# Altium project miniBackplane_SFP.PrjPCB
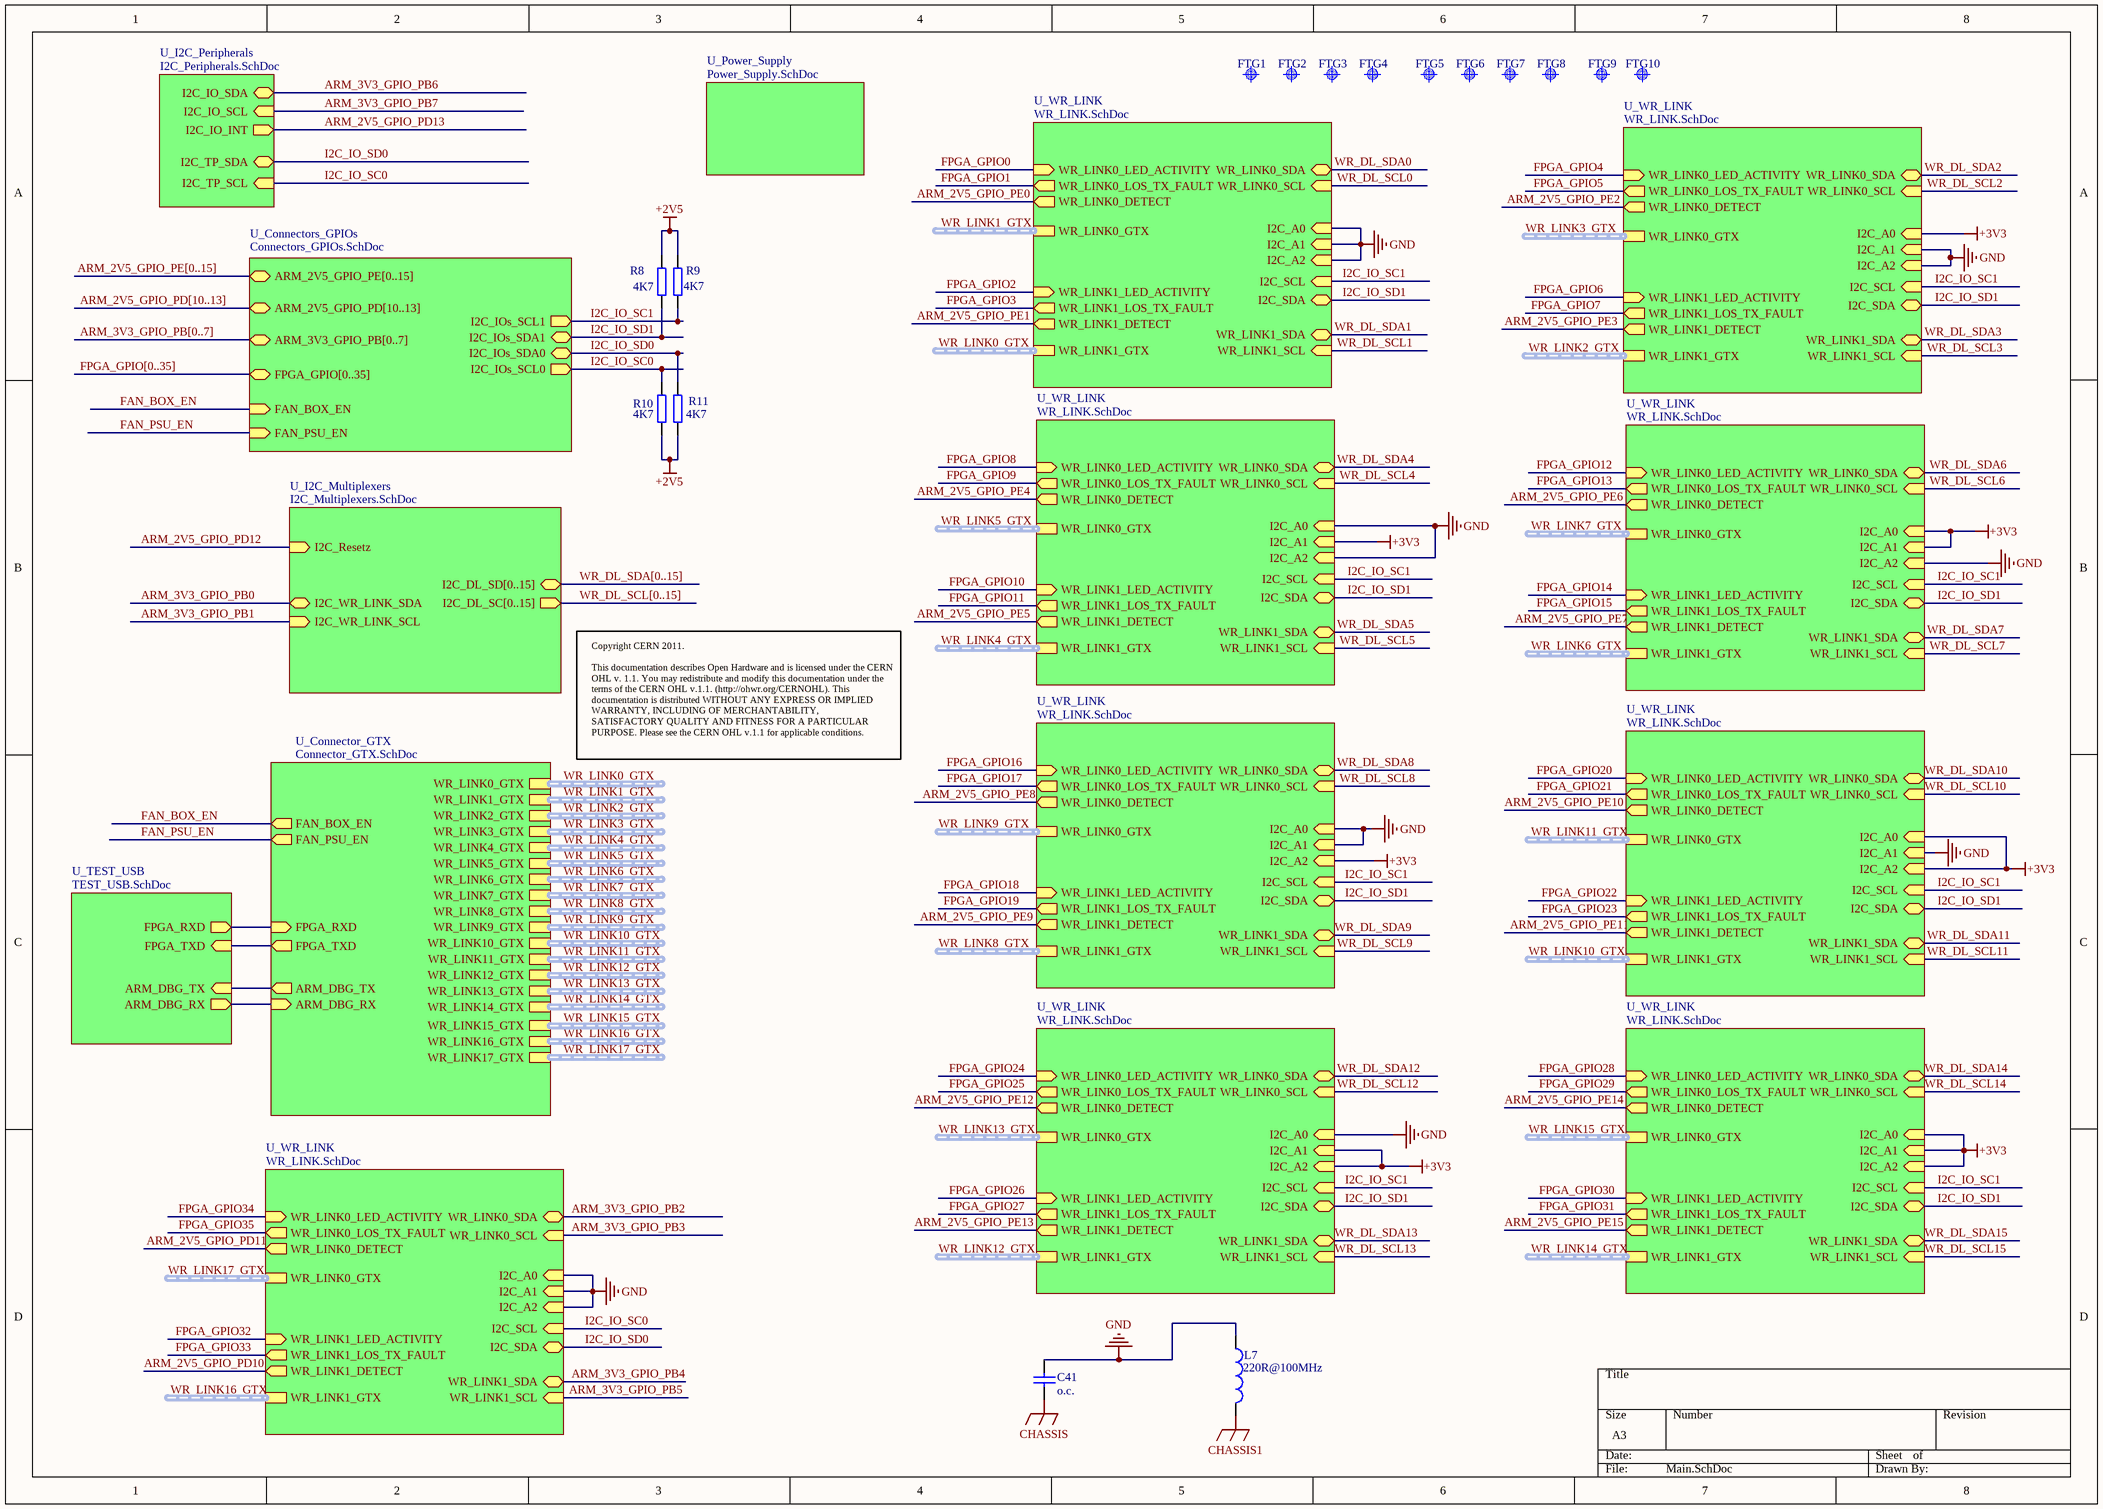
[diagram p0: Main.SchDoc]
3 sheets, 66 parts. Net scope: hierarchical (ports join the sheet entries above them; power ports are global).
Board file: miniBackplane.PcbDoc
Sheets:
  Main.SchDoc
    U_TEST_USB = TEST_USB.SchDoc
    U_Connectors_GPIOs = Connectors_GPIOs.SchDoc

## Sheet Main.SchDoc
size A3

### Parts
C41  o.c.  [CC1608-0603]
FTG1  Use only in PCB  [FIDUCIAL_TOP_S100-200]  (value not drawn)
FTG2  Use only in PCB  [FIDUCIAL_TOP_S100-200]  (value not drawn)
FTG3  Use only in PCB  [FIDUCIAL_TOP_S100-200]  (value not drawn)
FTG4  Use only in PCB  [FIDUCIAL_TOP_S100-200]  (value not drawn)
FTG5  Use only in PCB  [FIDUCIAL_TOP_S100-200]  (value not drawn)
FTG6  Use only in PCB  [FIDUCIAL_TOP_S100-200]  (value not drawn)
FTG7  Use only in PCB  [FIDUCIAL_TOP_S100-200]  (value not drawn)
FTG8  Use only in PCB  [FIDUCIAL_TOP_S100-200]  (value not drawn)
FTG9  Use only in PCB  [FIDUCIAL_TOP_S100-200]  (value not drawn)
FTG10  Use only in PCB  [FIDUCIAL_TOP_S100-200]  (value not drawn)
L7  Impedance: 220R@100MHz  [0603]  (hidden comment: 220R@100MHz Ferrite Bead)
R8  4K7  [0603]
R9  4K7  [0603]
R10  4K7  [0603]
R11  4K7  [0603]

### Sub-sheets
U_Connector_GTX = Connector_GTX.SchDoc (file not in this document): WR_LINK0_GTX (harness WR_LINK_GTX), WR_LINK1_GTX (harness WR_LINK_GTX), WR_LINK2_GTX (harness WR_LINK_GTX), WR_LINK3_GTX (harness WR_LINK_GTX), WR_LINK4_GTX (harness WR_LINK_GTX), WR_LINK5_GTX (harness WR_LINK_GTX), WR_LINK6_GTX (harness WR_LINK_GTX), WR_LINK7_GTX (harness WR_LINK_GTX), WR_LINK8_GTX (harness WR_LINK_GTX), WR_LINK9_GTX (harness WR_LINK_GTX), WR_LINK10_GTX (harness WR_LINK_GTX), WR_LINK11_GTX (harness WR_LINK_GTX), WR_LINK17_GTX (harness WR_LINK_GTX), WR_LINK16_GTX (harness WR_LINK_GTX), WR_LINK15_GTX (harness WR_LINK_GTX), WR_LINK14_GTX (harness WR_LINK_GTX), WR_LINK13_GTX (harness WR_LINK_GTX), WR_LINK12_GTX (harness WR_LINK_GTX), FPGA_RXD (in), FPGA_TXD (out), ARM_DBG_TX (out), ARM_DBG_RX (in), FAN_BOX_EN (out), FAN_PSU_EN (out)
U_Connectors_GPIOs = Connectors_GPIOs.SchDoc: ARM_2V5_GPIO_PE[0..15] (bidir), FPGA_GPIO[0..35] (bidir), I2C_IOs_SCL1 (out), I2C_IOs_SDA1 (bidir), I2C_IOs_SCL0 (out), I2C_IOs_SDA0 (bidir), ARM_2V5_GPIO_PD[10..13] (bidir), ARM_3V3_GPIO_PB[0..7] (bidir), FAN_BOX_EN (in), FAN_PSU_EN (in)
U_I2C_Multiplexers = I2C_Multiplexers.SchDoc (file not in this document): I2C_DL_SD[0..15] (bidir), I2C_DL_SC[0..15] (out), I2C_Resetz (in), I2C_WR_LINK_SDA (bidir), I2C_WR_LINK_SCL (in)
U_I2C_Peripherals = I2C_Peripherals.SchDoc (file not in this document): I2C_IO_SDA (bidir), I2C_IO_SCL (in), I2C_IO_INT (out), I2C_TP_SDA (bidir), I2C_TP_SCL (in)
U_Power_Supply = Power_Supply.SchDoc (file not in this document): no entries
U_TEST_USB = TEST_USB.SchDoc: FPGA_RXD (out), FPGA_TXD (in), ARM_DBG_TX (in), ARM_DBG_RX (out)
U_WR_LINK = WR_LINK.SchDoc (file not in this document): WR_LINK0_GTX (harness WR_LINK_GTX), I2C_A0 (in), I2C_A1 (in), I2C_A2 (in), I2C_SDA (bidir), I2C_SCL (in), WR_LINK0_SDA (bidir), WR_LINK0_SCL (in), WR_LINK0_DETECT (out), WR_LINK0_LOS_TX_FAULT (out), WR_LINK0_LED_ACTIVITY (in), WR_LINK1_LED_ACTIVITY (in), WR_LINK1_GTX (harness WR_LINK_GTX), WR_LINK1_SDA (bidir), WR_LINK1_SCL (in), WR_LINK1_DETECT (out), WR_LINK1_LOS_TX_FAULT (out)
U_WR_LINK = WR_LINK.SchDoc (file not in this document): WR_LINK0_GTX (harness WR_LINK_GTX), I2C_A0 (in), I2C_A1 (in), I2C_A2 (in), I2C_SDA (bidir), I2C_SCL (in), WR_LINK0_SDA (bidir), WR_LINK0_SCL (in), WR_LINK0_DETECT (out), WR_LINK0_LOS_TX_FAULT (out), WR_LINK0_LED_ACTIVITY (in), WR_LINK1_LED_ACTIVITY (in), WR_LINK1_GTX (harness WR_LINK_GTX), WR_LINK1_SDA (bidir), WR_LINK1_SCL (in), WR_LINK1_DETECT (out), WR_LINK1_LOS_TX_FAULT (out)
U_WR_LINK = WR_LINK.SchDoc (file not in this document): WR_LINK0_GTX (harness WR_LINK_GTX), I2C_A0 (in), I2C_A1 (in), I2C_A2 (in), I2C_SDA (bidir), I2C_SCL (in), WR_LINK0_SDA (bidir), WR_LINK0_SCL (in), WR_LINK0_DETECT (out), WR_LINK0_LOS_TX_FAULT (out), WR_LINK0_LED_ACTIVITY (in), WR_LINK1_LED_ACTIVITY (in), WR_LINK1_GTX (harness WR_LINK_GTX), WR_LINK1_SDA (bidir), WR_LINK1_SCL (in), WR_LINK1_DETECT (out), WR_LINK1_LOS_TX_FAULT (out)
U_WR_LINK = WR_LINK.SchDoc (file not in this document): WR_LINK0_GTX (harness WR_LINK_GTX), I2C_A0 (in), I2C_A1 (in), I2C_A2 (in), I2C_SDA (bidir), I2C_SCL (in), WR_LINK0_SDA (bidir), WR_LINK0_SCL (in), WR_LINK0_DETECT (out), WR_LINK0_LOS_TX_FAULT (out), WR_LINK0_LED_ACTIVITY (in), WR_LINK1_LED_ACTIVITY (in), WR_LINK1_GTX (harness WR_LINK_GTX), WR_LINK1_SDA (bidir), WR_LINK1_SCL (in), WR_LINK1_DETECT (out), WR_LINK1_LOS_TX_FAULT (out)
U_WR_LINK = WR_LINK.SchDoc (file not in this document): WR_LINK0_GTX (harness WR_LINK_GTX), I2C_A0 (in), I2C_A1 (in), I2C_A2 (in), I2C_SDA (bidir), I2C_SCL (in), WR_LINK0_SDA (bidir), WR_LINK0_SCL (in), WR_LINK0_DETECT (out), WR_LINK0_LOS_TX_FAULT (out), WR_LINK0_LED_ACTIVITY (in), WR_LINK1_LED_ACTIVITY (in), WR_LINK1_GTX (harness WR_LINK_GTX), WR_LINK1_SDA (bidir), WR_LINK1_SCL (in), WR_LINK1_DETECT (out), WR_LINK1_LOS_TX_FAULT (out)
U_WR_LINK = WR_LINK.SchDoc (file not in this document): WR_LINK0_GTX (harness WR_LINK_GTX), I2C_A0 (in), I2C_A1 (in), I2C_A2 (in), I2C_SDA (bidir), I2C_SCL (in), WR_LINK0_SDA (bidir), WR_LINK0_SCL (in), WR_LINK0_DETECT (out), WR_LINK0_LOS_TX_FAULT (out), WR_LINK0_LED_ACTIVITY (in), WR_LINK1_LED_ACTIVITY (in), WR_LINK1_GTX (harness WR_LINK_GTX), WR_LINK1_SDA (bidir), WR_LINK1_SCL (in), WR_LINK1_DETECT (out), WR_LINK1_LOS_TX_FAULT (out)
U_WR_LINK = WR_LINK.SchDoc (file not in this document): WR_LINK0_GTX (harness WR_LINK_GTX), I2C_A0 (in), I2C_A1 (in), I2C_A2 (in), I2C_SDA (bidir), I2C_SCL (in), WR_LINK0_SDA (bidir), WR_LINK0_SCL (in), WR_LINK0_DETECT (out), WR_LINK0_LOS_TX_FAULT (out), WR_LINK0_LED_ACTIVITY (in), WR_LINK1_LED_ACTIVITY (in), WR_LINK1_GTX (harness WR_LINK_GTX), WR_LINK1_SDA (bidir), WR_LINK1_SCL (in), WR_LINK1_DETECT (out), WR_LINK1_LOS_TX_FAULT (out)
U_WR_LINK = WR_LINK.SchDoc (file not in this document): WR_LINK0_GTX (harness WR_LINK_GTX), I2C_A0 (in), I2C_A1 (in), I2C_A2 (in), I2C_SDA (bidir), I2C_SCL (in), WR_LINK0_SDA (bidir), WR_LINK0_SCL (in), WR_LINK0_DETECT (out), WR_LINK0_LOS_TX_FAULT (out), WR_LINK0_LED_ACTIVITY (in), WR_LINK1_LED_ACTIVITY (in), WR_LINK1_GTX (harness WR_LINK_GTX), WR_LINK1_SDA (bidir), WR_LINK1_SCL (in), WR_LINK1_DETECT (out), WR_LINK1_LOS_TX_FAULT (out)
U_WR_LINK = WR_LINK.SchDoc (file not in this document): WR_LINK0_GTX (harness WR_LINK_GTX), I2C_A0 (in), I2C_A1 (in), I2C_A2 (in), I2C_SDA (bidir), I2C_SCL (in), WR_LINK0_SDA (bidir), WR_LINK0_SCL (in), WR_LINK0_DETECT (out), WR_LINK0_LOS_TX_FAULT (out), WR_LINK0_LED_ACTIVITY (in), WR_LINK1_LED_ACTIVITY (in), WR_LINK1_GTX (harness WR_LINK_GTX), WR_LINK1_SDA (bidir), WR_LINK1_SCL (in), WR_LINK1_DETECT (out), WR_LINK1_LOS_TX_FAULT (out)

### Nets
+2V5: R8.2 R9.1 R10.2 R11.1
+3V3: sheet U_WR_LINK/I2C_A0, sheet U_WR_LINK/I2C_A1, sheet U_WR_LINK/I2C_A0, sheet U_WR_LINK/I2C_A1, sheet U_WR_LINK/I2C_A2, sheet U_WR_LINK/I2C_A0, sheet U_WR_LINK/I2C_A2, sheet U_WR_LINK/I2C_A1, sheet U_WR_LINK/I2C_A2, sheet U_WR_LINK/I2C_A0, sheet U_WR_LINK/I2C_A1, sheet U_WR_LINK/I2C_A2
CHASSIS: C41.1
CHASSIS1: L7.2
GND: C41.2 L7.1 ; sheet U_WR_LINK/I2C_A0, sheet U_WR_LINK/I2C_A1, sheet U_WR_LINK/I2C_A2, sheet U_WR_LINK/I2C_A1, sheet U_WR_LINK/I2C_A2, sheet U_WR_LINK/I2C_A0, sheet U_WR_LINK/I2C_A2, sheet U_WR_LINK/I2C_A2, sheet U_WR_LINK/I2C_A0, sheet U_WR_LINK/I2C_A1, sheet U_WR_LINK/I2C_A1, sheet U_WR_LINK/I2C_A0, sheet U_WR_LINK/I2C_A0, sheet U_WR_LINK/I2C_A1, sheet U_WR_LINK/I2C_A2
FAN_BOX_EN: sheet U_Connector_GTX/FAN_BOX_EN, sheet U_Connectors_GPIOs/FAN_BOX_EN
FAN_PSU_EN: sheet U_Connector_GTX/FAN_PSU_EN, sheet U_Connectors_GPIOs/FAN_PSU_EN
I2C_IO_SC0: R10.1 ; sheet U_Connectors_GPIOs/I2C_IOs_SCL0, sheet U_WR_LINK/I2C_SCL, sheet U_I2C_Peripherals/I2C_TP_SCL  [project net FPGA-GPIO37]
I2C_IO_SC1: R9.2 ; sheet U_Connectors_GPIOs/I2C_IOs_SCL1, sheet U_WR_LINK/I2C_SCL, sheet U_WR_LINK/I2C_SCL, sheet U_WR_LINK/I2C_SCL, sheet U_WR_LINK/I2C_SCL, sheet U_WR_LINK/I2C_SCL, sheet U_WR_LINK/I2C_SCL, sheet U_WR_LINK/I2C_SCL, sheet U_WR_LINK/I2C_SCL  [project net FPGA-GPIO39]
I2C_IO_SD0: R11.2 ; sheet U_Connectors_GPIOs/I2C_IOs_SDA0, sheet U_WR_LINK/I2C_SDA, sheet U_I2C_Peripherals/I2C_TP_SDA  [project net FPGA-GPIO36]
I2C_IO_SD1: R8.1 ; sheet U_Connectors_GPIOs/I2C_IOs_SDA1, sheet U_WR_LINK/I2C_SDA, sheet U_WR_LINK/I2C_SDA, sheet U_WR_LINK/I2C_SDA, sheet U_WR_LINK/I2C_SDA, sheet U_WR_LINK/I2C_SDA, sheet U_WR_LINK/I2C_SDA, sheet U_WR_LINK/I2C_SDA, sheet U_WR_LINK/I2C_SDA  [project net FPGA-GPIO38]
WR_DL_SCL0: sheet U_WR_LINK/WR_LINK0_SCL
WR_DL_SCL1: sheet U_WR_LINK/WR_LINK1_SCL
WR_DL_SCL2: sheet U_WR_LINK/WR_LINK0_SCL
WR_DL_SCL3: sheet U_WR_LINK/WR_LINK1_SCL
WR_DL_SCL4: sheet U_WR_LINK/WR_LINK0_SCL
WR_DL_SCL5: sheet U_WR_LINK/WR_LINK1_SCL
WR_DL_SCL6: sheet U_WR_LINK/WR_LINK0_SCL
WR_DL_SCL7: sheet U_WR_LINK/WR_LINK1_SCL
WR_DL_SCL8: sheet U_WR_LINK/WR_LINK0_SCL
WR_DL_SCL9: sheet U_WR_LINK/WR_LINK1_SCL
WR_DL_SCL10: sheet U_WR_LINK/WR_LINK0_SCL
WR_DL_SCL11: sheet U_WR_LINK/WR_LINK1_SCL
WR_DL_SCL12: sheet U_WR_LINK/WR_LINK0_SCL
WR_DL_SCL13: sheet U_WR_LINK/WR_LINK1_SCL
WR_DL_SCL14: sheet U_WR_LINK/WR_LINK0_SCL
WR_DL_SCL15: sheet U_WR_LINK/WR_LINK1_SCL
WR_DL_SDA0: sheet U_WR_LINK/WR_LINK0_SDA
WR_DL_SDA1: sheet U_WR_LINK/WR_LINK1_SDA
WR_DL_SDA2: sheet U_WR_LINK/WR_LINK0_SDA
WR_DL_SDA3: sheet U_WR_LINK/WR_LINK1_SDA
WR_DL_SDA4: sheet U_WR_LINK/WR_LINK0_SDA
WR_DL_SDA5: sheet U_WR_LINK/WR_LINK1_SDA
WR_DL_SDA6: sheet U_WR_LINK/WR_LINK0_SDA
WR_DL_SDA7: sheet U_WR_LINK/WR_LINK1_SDA
WR_DL_SDA8: sheet U_WR_LINK/WR_LINK0_SDA
WR_DL_SDA9: sheet U_WR_LINK/WR_LINK1_SDA
WR_DL_SDA10: sheet U_WR_LINK/WR_LINK0_SDA
WR_DL_SDA11: sheet U_WR_LINK/WR_LINK1_SDA
WR_DL_SDA12: sheet U_WR_LINK/WR_LINK0_SDA
WR_DL_SDA13: sheet U_WR_LINK/WR_LINK1_SDA
WR_DL_SDA14: sheet U_WR_LINK/WR_LINK0_SDA
WR_DL_SDA15: sheet U_WR_LINK/WR_LINK1_SDA
NetIC2_25: sheet U_Connector_GTX/FPGA_TXD, sheet U_TEST_USB/FPGA_TXD
NetIC8_25: sheet U_Connector_GTX/ARM_DBG_TX, sheet U_TEST_USB/ARM_DBG_TX
NetR33_2: sheet U_Connector_GTX/FPGA_RXD, sheet U_TEST_USB/FPGA_RXD
NetR44_1: sheet U_Connector_GTX/ARM_DBG_RX, sheet U_TEST_USB/ARM_DBG_RX

### Buses and harness runs
bus ARM_2V5_GPIO_PD[10..13] = sheet U_Connectors_GPIOs/ARM_2V5_GPIO_PD[10..13]
bus ARM_2V5_GPIO_PE[0..15] = sheet U_Connectors_GPIOs/ARM_2V5_GPIO_PE[0..15]
bus ARM_3V3_GPIO_PB[0..7] = sheet U_Connectors_GPIOs/ARM_3V3_GPIO_PB[0..7]
bus FPGA_GPIO[0..35] = sheet U_Connectors_GPIOs/FPGA_GPIO[0..35]
bus WR_DL_SCL[0..15] = sheet U_I2C_Multiplexers/I2C_DL_SC[0..15]
bus WR_DL_SDA[0..15] = sheet U_I2C_Multiplexers/I2C_DL_SD[0..15]
harness WR_LINK0_GTX = sheet U_Connector_GTX/WR_LINK0_GTX
harness WR_LINK0_GTX = sheet U_WR_LINK/WR_LINK1_GTX
harness WR_LINK1_GTX = sheet U_Connector_GTX/WR_LINK1_GTX
harness WR_LINK1_GTX = sheet U_WR_LINK/WR_LINK0_GTX
harness WR_LINK2_GTX = sheet U_Connector_GTX/WR_LINK2_GTX
harness WR_LINK2_GTX = sheet U_WR_LINK/WR_LINK1_GTX
harness WR_LINK3_GTX = sheet U_Connector_GTX/WR_LINK3_GTX
harness WR_LINK3_GTX = sheet U_WR_LINK/WR_LINK0_GTX
harness WR_LINK4_GTX = sheet U_Connector_GTX/WR_LINK4_GTX
harness WR_LINK4_GTX = sheet U_WR_LINK/WR_LINK1_GTX
harness WR_LINK5_GTX = sheet U_Connector_GTX/WR_LINK5_GTX
harness WR_LINK5_GTX = sheet U_WR_LINK/WR_LINK0_GTX
harness WR_LINK6_GTX = sheet U_Connector_GTX/WR_LINK6_GTX
harness WR_LINK6_GTX = sheet U_WR_LINK/WR_LINK1_GTX
harness WR_LINK7_GTX = sheet U_Connector_GTX/WR_LINK7_GTX
harness WR_LINK7_GTX = sheet U_WR_LINK/WR_LINK0_GTX
harness WR_LINK8_GTX = sheet U_Connector_GTX/WR_LINK8_GTX
harness WR_LINK8_GTX = sheet U_WR_LINK/WR_LINK1_GTX
harness WR_LINK9_GTX = sheet U_Connector_GTX/WR_LINK9_GTX
harness WR_LINK9_GTX = sheet U_WR_LINK/WR_LINK0_GTX
harness WR_LINK10_GTX = sheet U_Connector_GTX/WR_LINK10_GTX
harness WR_LINK10_GTX = sheet U_WR_LINK/WR_LINK1_GTX
harness WR_LINK11_GTX = sheet U_Connector_GTX/WR_LINK11_GTX
harness WR_LINK11_GTX = sheet U_WR_LINK/WR_LINK0_GTX
harness WR_LINK12_GTX = sheet U_Connector_GTX/WR_LINK12_GTX
harness WR_LINK12_GTX = sheet U_WR_LINK/WR_LINK1_GTX
harness WR_LINK13_GTX = sheet U_Connector_GTX/WR_LINK13_GTX
harness WR_LINK13_GTX = sheet U_WR_LINK/WR_LINK0_GTX
harness WR_LINK14_GTX = sheet U_Connector_GTX/WR_LINK14_GTX
harness WR_LINK14_GTX = sheet U_WR_LINK/WR_LINK1_GTX
harness WR_LINK15_GTX = sheet U_Connector_GTX/WR_LINK15_GTX
harness WR_LINK15_GTX = sheet U_WR_LINK/WR_LINK0_GTX
harness WR_LINK16_GTX = sheet U_Connector_GTX/WR_LINK16_GTX
harness WR_LINK16_GTX = sheet U_WR_LINK/WR_LINK1_GTX
harness WR_LINK17_GTX = sheet U_Connector_GTX/WR_LINK17_GTX
harness WR_LINK17_GTX = sheet U_WR_LINK/WR_LINK0_GTX

### Notes on the sheet
- Copyright CERN 2011.
  This documentation describes Open Hardware and is licensed under the CERN OHL v. 1.1. You may redistribute and modify this documentation under the terms of the CERN OHL v.1.1. (http://ohwr.org/CERNOHL). This documentation is distributed WITHOUT ANY EXPRESS OR IMPLIED WARRANTY, INCLUDING OF MERCHANTABILITY, SATISFACTORY QUALITY AND FITNESS FOR A PARTICULAR PURPOSE. Please see the CERN OHL v.1.1 for applicable conditions.

### Library data of the parts
C41 = CC0603_O.C.: Capacitor; Manufacturer1: Phycomp; TC: X7R; Tolerance: ±10%; Voltage: 16V; Published: 8-Jun-2000; LatestRevisionDate: 17-Jul-2002; LatestRevisionNote: Re-released for DXP Platform.; PackageReference: RAD-0.3; Publisher: Altium Limited; Manufacturer1 PN: *; Distributor1: Digikey; Distributor1 PN: *; Case: 0603; Value: o.c.
FTG1-FTG10 = Fiducial Target: Part Number: FIDUCIAL_TARGET_S100-200; Part Description: Scare Fiducial Target, Top Layer, 1.0mm, Top Sloder 2.0mm, Keepout =2.0mm; Mounted: No; Table: Pads; Component Kind: Standard (No BOM); Component Type: Standard (No BOM); Pin Count: 1; Family: Fiducial; Socket: No; SMD: Yes; Status: None; ComponentHeight: 0mm; Author: CERN DEM JLC; CreateDate: 2/9/2010; LatestRevisionDate: 2/9/2010; PackageDescription: Scare Fiducial Target, Top Layer, 1.0mm, Top Sloder 2.0mm, Keepout =2.0mm
L7 = L_FERRITE_BEAD: ferrite bead; Manufacturer1: Murata; Manufacturer1 PN: BLM18KG221SN1D; Current Rating: 2.2A; DCR: 50mOhm; Case: 0603; Distributor1: Digikey; Distributor1 PN: 490-5255-1-ND
R8-R11 = R0603_4.7K_±1%_0.1W_100PPM: SMD Resistor; Manufacturer1: Panasonic; Manufacturer1 PN: ERJ-3EKF4701V; TCR: 100ppm; Power Rating: 0.1W; Tolerance: ±1%; Case: 0603; Distributor1: DigiKey; Distributor1 PN: P4.70KHCT-ND; Value: 4K7

## Sheet TEST_USB.SchDoc
size A4
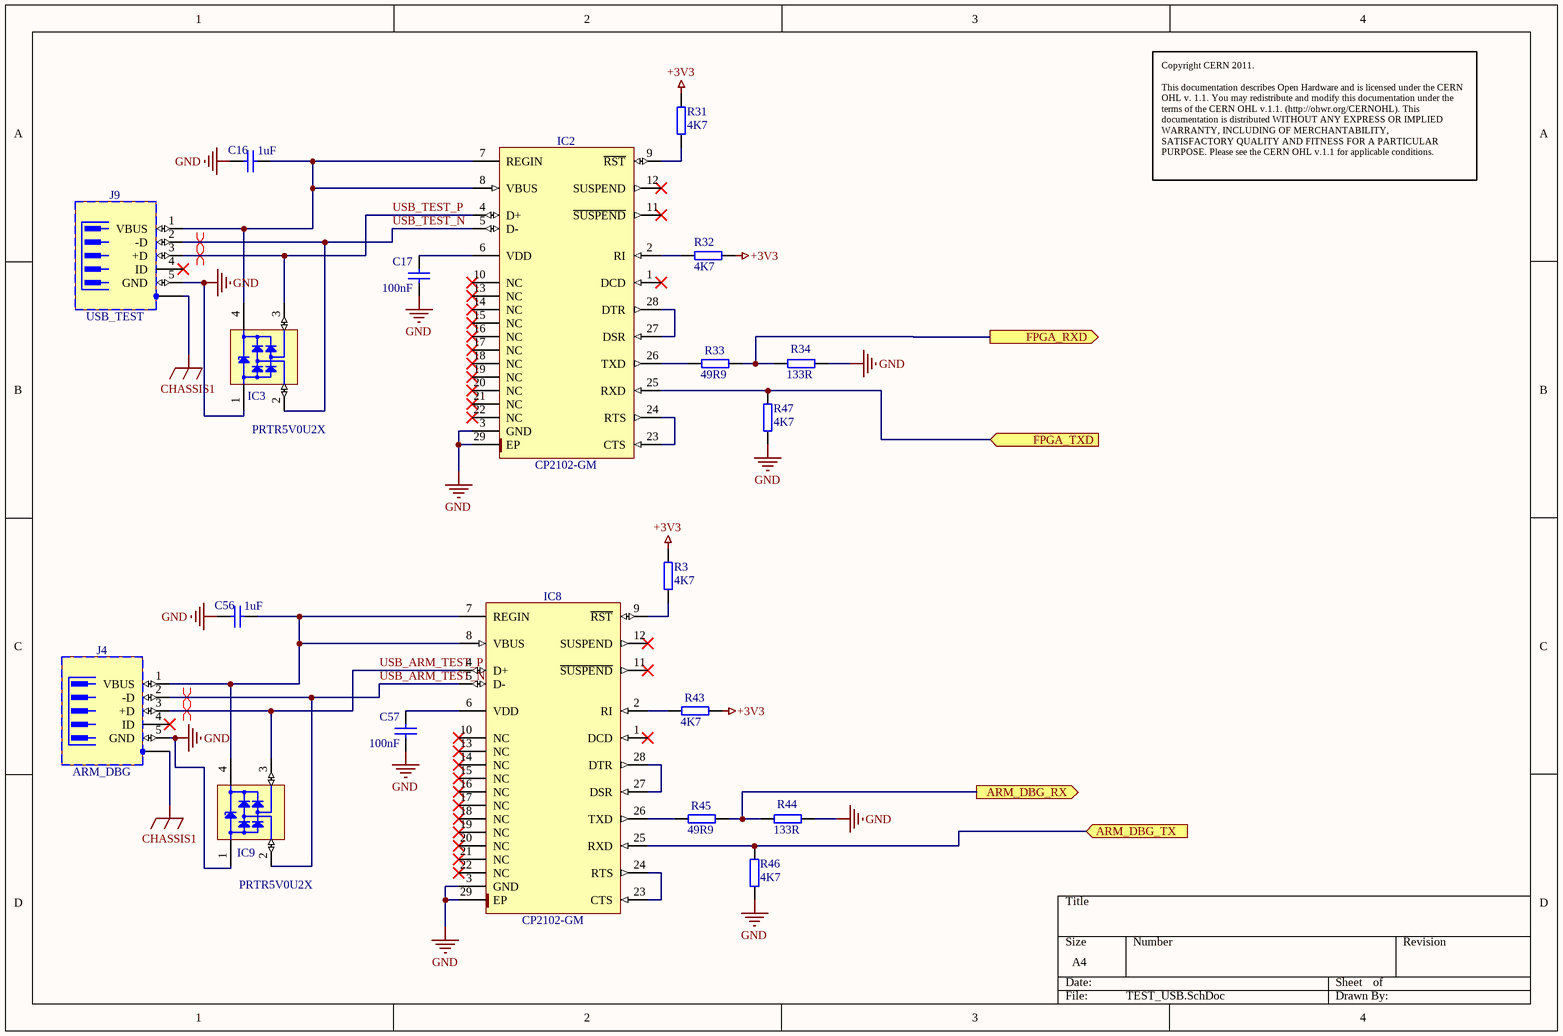
[diagram p1: TEST_USB.SchDoc]

### Parts
C16  1uF  [CC1608-0603]
C17  100nF  [CC1608-0603]
C56  1uF  [CC1608-0603]
C57  100nF  [CC1608-0603]
IC2  CP2102-GM  [QFN50P500X500X100-29N-S335]
IC3  PRTR5V0U2X  [SOT190P230X110-4N]
IC8  CP2102-GM  [QFN50P500X500X100-29N-S335]
IC9  PRTR5V0U2X  [SOT190P230X110-4N]
J4  ARM_DBG  [TYCO_1734035-1]
J9  USB_TEST  [TYCO_1734035-1]
R3  4K7  [0603]
R31  4K7  [0603]
R32  4K7  [0603]
R33  49R9  [0603]
R34  133R  [0603]
R43  4K7  [0603]
R44  133R  [0603]
R45  49R9  [0603]
R46  4K7  [0603]
R47  4K7  [0603]

### Ports
ARM_DBG_RX (out), ARM_DBG_TX (in), FPGA_RXD (out), FPGA_TXD (in)

### Nets
+3V3: R3.1 R31.1 R32.2 R43.2
CHASSIS1: J4.6(SH) J9.6(SH)
GND: C16.1 C17.2 C56.1 C57.2 IC2.3(GND) IC2.29(EP) IC3.1(GND) IC8.3(GND) IC8.29(EP) IC9.1(GND) J4.5(GND) J9.5(GND) R34.2 R44.2 R46.2 R47.2
USB_ARM_TEST_N: IC8.5(D-) IC9.2(I/O1) J4.2(-D)
USB_ARM_TEST_P: IC8.4(D+) IC9.3(I/O2) J4.3(+D)
USB_TEST_N: IC2.5(D-) IC3.2(I/O1) J9.2(-D)
USB_TEST_P: IC2.4(D+) IC3.3(I/O2) J9.3(+D)
NetC16_2: C16.2 IC2.7(REGIN) IC2.8(VBUS) IC3.4(VCC) J9.1(VBUS)
NetC17_1: C17.1 IC2.6(VDD)
NetC56_2: C56.2 IC8.7(REGIN) IC8.8(VBUS) IC9.4(VCC) J4.1(VBUS)
NetC57_1: C57.1 IC8.6(VDD)
NetIC2_2: IC2.2(RI) R32.1
NetIC2_9: IC2.9(~{RST}) R31.2
NetIC2_23: IC2.23(CTS) IC2.24(RTS)
NetIC2_25: IC2.25(RXD) R47.1 ; port FPGA_TXD
NetIC2_26: IC2.26(TXD) R33.1
NetIC2_27: IC2.27(DSR) IC2.28(DTR)
NetIC8_2: IC8.2(RI) R43.1
NetIC8_9: IC8.9(~{RST}) R3.2
NetIC8_23: IC8.23(CTS) IC8.24(RTS)
NetIC8_25: IC8.25(RXD) R46.1 ; port ARM_DBG_TX
NetIC8_26: IC8.26(TXD) R45.1
NetIC8_27: IC8.27(DSR) IC8.28(DTR)
NetR33_2: R33.2 R34.1 ; port FPGA_RXD
NetR44_1: R44.1 R45.2 ; port ARM_DBG_RX

Not connected (* = marked no-connect by the designer): IC2 1(DCD)* 10(NC)* 11(~{SUSPEND})* 12(SUSPEND)* 13(NC)* 14(NC)* 15(NC)* 16(NC)* 17(NC)* 18(NC)* 19(NC)* 20(NC)* 21(NC)* 22(NC)*; IC8 1(DCD)* 10(NC)* 11(~{SUSPEND})* 12(SUSPEND)* 13(NC)* 14(NC)* 15(NC)* 16(NC)* 17(NC)* 18(NC)* 19(NC)* 20(NC)* 21(NC)* 22(NC)*; J4 4(ID)*; J9 4(ID)*

### Layout directives
differential pair: USB_ARM_TEST_N, USB_ARM_TEST_P, USB_TEST_N, USB_TEST_P

### Notes on the sheet
- Copyright CERN 2011.
  This documentation describes Open Hardware and is licensed under the CERN OHL v. 1.1. You may redistribute and modify this documentation under the terms of the CERN OHL v.1.1. (http://ohwr.org/CERNOHL). This documentation is distributed WITHOUT ANY EXPRESS OR IMPLIED WARRANTY, INCLUDING OF MERCHANTABILITY, SATISFACTORY QUALITY AND FITNESS FOR A PARTICULAR PURPOSE. Please see the CERN OHL v.1.1 for applicable conditions.

### Library data of the parts
C16 C56 = CC0603_1UF_25V_10%_X5R: Capacitor; Manufacturer1: Phycomp; Manufacturer1 PN: GRM188R61E105KA12D; TC: X5R; Tolerance: ±10%; Voltage: 25V; Published: 8-Jun-2000; LatestRevisionDate: 17-Jul-2002; LatestRevisionNote: Re-released for DXP Platform.; Publisher: Altium Limited; Distributor1: Digikey; Distributor1 PN: 490-3897-1-ND; Case: 0603; Value: 1uF
C17 C57 = CC0603_100NF_16V_10%_X7R: Capacitor; Manufacturer1: AVX; Manufacturer1 PN: 0603YC104KAT2A; TC: X7R; Tolerance: ±10%; Voltage: 16V; Published: 8-Jun-2000; LatestRevisionDate: 17-Jul-2002; LatestRevisionNote: Re-released for DXP Platform.; PackageReference: RAD-0.3; Publisher: Altium Limited; Distributor1: Digikey; Distributor1 PN: 478-1239-1-ND; Case: 0603; Value: 100nF
IC2 IC8 = CP2102-GM: Single-Chip USB to UART Bridge; Manufacturer: SILICON LABS; Table: Analog & Interface; Part Number: CP2102-GM; Component Kind: Standard; Component Type: Standard; Device: CP2102-GM; PackageDescription: QFN, 0.50mm Pitch, Square; 28 pin, 5.00mm L X 5.00mm W X 1.00mm H body (w/thermal tab 3.35 X 3.35mm),  IPC Medium Density; Part Description: Single-Chip USB to UART Bridge; Manufacturer Part Number: CP2102-GM; Pin Count: 29; Case: QFN28; Mounted: Yes; Socket: No; SMD: Yes; ComponentHeight: 1.0mm; Author: CERN DEM JLC; HelpURL: \\cern.ch\dfs\Applications\Altium\Datasheets\CP2102-GM.pdf; CreateDate: 3/3/2011; LatestRevisionDate: 3/3/2011
IC3 IC9 = PRTR5V0U2X: Ultra Low Capacitance Double Rail-to-Rail ESD Protection Diode; Part Description: Ultra Low Capacitance (1pF) Double Rail-to-Rail ESD Protection Diode (8kV); Manufacturer: PHILIPS NXP; Voltage: 5.5V; Table: Diodes; Part Number: PRTR5V0U2X; Component Kind: Standard; Component Type: Standard; Device: PRTR5V0U2X; PackageDescription: SOT143B, SOT, 1.90mm Pitch; 4 Pin, 1.30mm W X 2.90mm L X 1.10mm H body, IPC Medium Density; Manufacturer Part Number: PRTR5V0U2X; Pin Count: 4; Case: SOT143B; Mounted: Yes; Socket: No; SMD: Yes; ComponentHeight: 1.1mm; HelpURL: \\cern.ch\dfs\Applications\Altium\Datasheets\PRTR5V0U2X.pdf; Author: CERN DEM JLC; CreateDate: 3/22/2011; LatestRevisionDate: 3/22/2011
J4 J9 = TYCO_1734035-1: 5 Pin + 1 Shield Mini USB Type B Receptacle; Part Description: 5 Position, Right Angle, SMD Mini USB Type B Receptacle; Manufacturer: TYCO ELECTRONICS; Table: TYCO; Part Number: TYCO_1734035-1; Component Kind: Standard; Component Type: Standard; Pin Count: 6; Family: USB; Mounted: Yes; Socket: No; SMD: Yes; Status: None; Manufacturer Part Number: 1734035-1; ComponentHeight: 3.95mm; HelpURL: \\cern.ch\dfs\Applications\Altium\Datasheets\TYCO_1734035-1.pdf; Author: CERN DEM JLC; CreateDate: 02/05/2011; LatestRevisionDate: 02/05/2011
R3 R31 R32 R43 R46 R47 = R0603_4.7K_±1%_0.1W_100PPM: as R8 on sheet Main; Case: 0603; Distributor1: DigiKey; Distributor1 PN: P4.70KHCT-ND; Value: 4K7
R33 R45 = R0603_49R9_±1%_0.25W_100PPM: SMD Resistor; Manufacturer1: Vishay/Dale; Manufacturer1 PN: CRCW060349R9FKEAHP; TCR: 100ppm; Power Rating: 0.25W; Tolerance: ±1%; Case: 0603; Distributor1: DigiKey; Distributor1 PN: 541-49.9SCT-ND; Value: 49R9
R34 R44 = R0603_133R_±1%_0.1W_100PPM: SMD Resistor; Manufacturer1: Yageo; Manufacturer1 PN: 311-133HRCT-ND; TCR: 100ppm; Power Rating: 0.1W; Tolerance: ±1%; Case: 0603; Distributor1: DigiKey; Distributor1 PN: RC0603FR-07133RL; Value: 133R

## Sheet Connectors_GPIOs.SchDoc
size A3
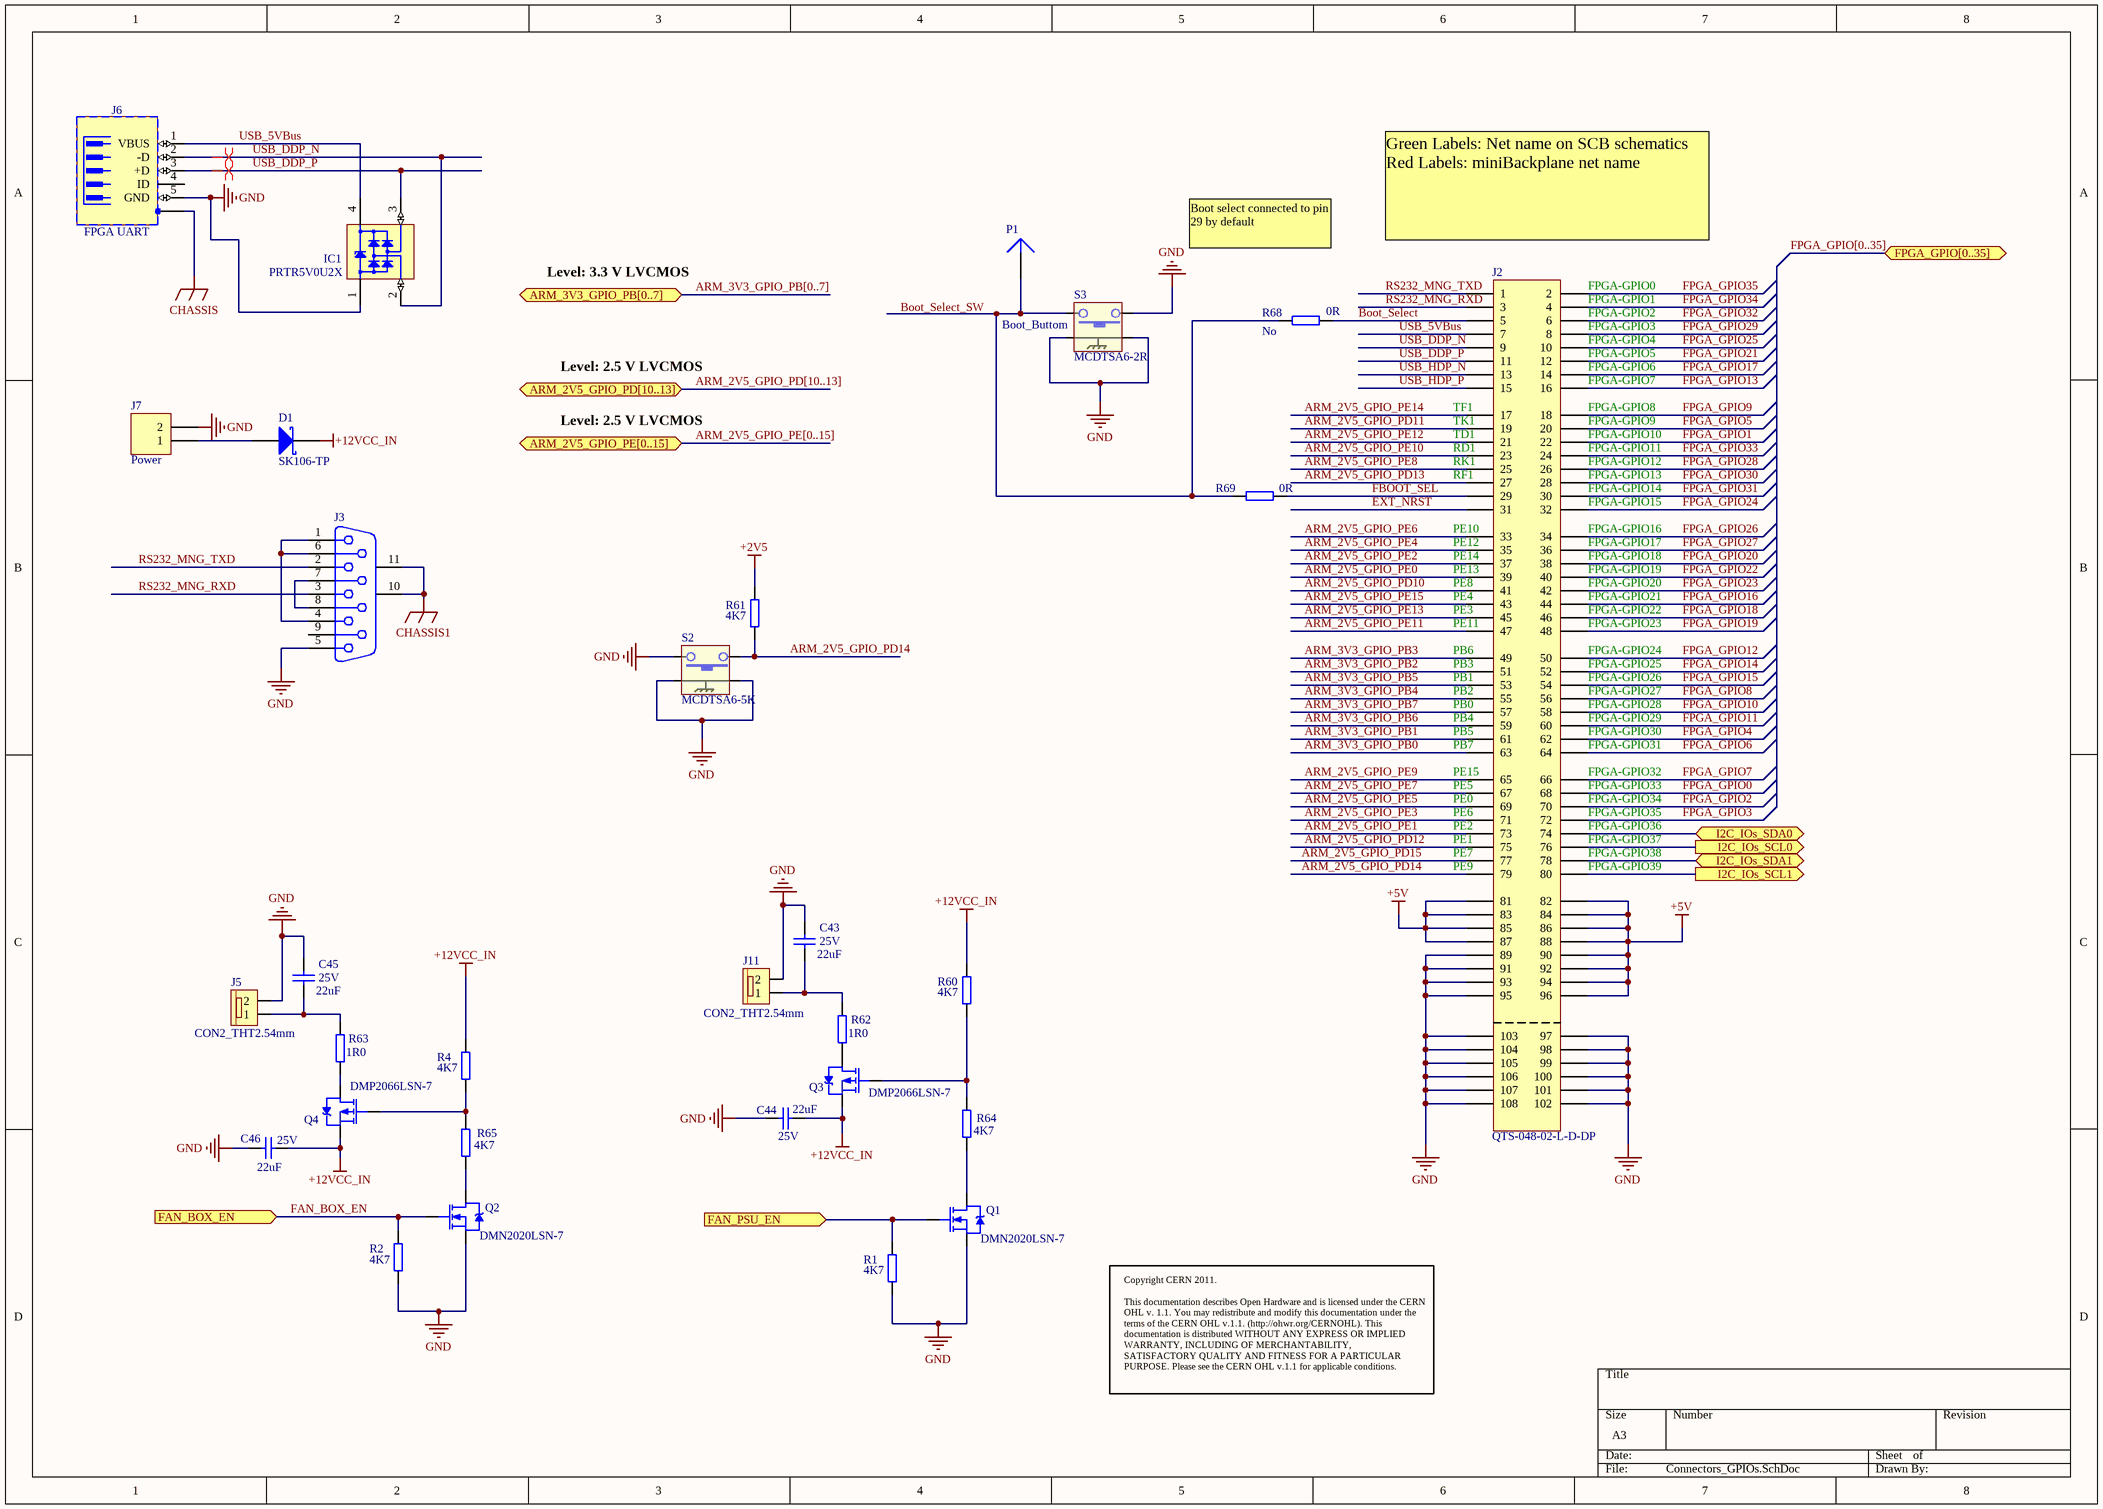
[diagram p2: Connectors_GPIOs.SchDoc]

### Parts
C43  value 22uF  Voltage: 25V  [CC3216-1206]  (hidden comment: 22uF 25V)
C44  value 22uF  Voltage: 25V  [CC3216-1206]  (hidden comment: 22uF 25V)
C45  value 22uF  Voltage: 25V  [CC3216-1206]  (hidden comment: 22uF 25V)
C46  value 22uF  Voltage: 25V  [CC3216-1206]  (hidden comment: 22uF 25V)
D1  SK106-TP  [DO-214AB/SMB-MCC]
IC1  PRTR5V0U2X  [SOT190P230X110-4N]
J2  QTS-048-02-L-D-DP  [QTS-048-XX-X-D-DP-A]
J3  D Connector 9  [DSUB1.385-2H9]  (value not drawn)
J5  CON2_THT2.54mm  [Wurth_619_0xx]
J6  FPGA UART  [TYCO_1734035-1]
J7  Power  [TYCO_794120_1]
J11  CON2_THT2.54mm  [Wurth_619_0xx]
P1  Boot_Buttom  [PIN1-RT-01T-1.0B(LF)]
Q1  DMN2020LSN-7  [SC-59-3]
Q2  DMN2020LSN-7  [SC-59-3]
Q3  DMP2066LSN-7  [SC-59-3]
Q4  DMP2066LSN-7  [SC-59-3]
R1  4K7  [0603]
R2  4K7  [0603]
R4  4K7  [0603]
R60  4K7  [0603]
R61  4K7  [0603]
R62  1R0  [CR3225-1210]
R63  1R0  [CR3225-1210]
R64  4K7  [0603]
R65  4K7  [0603]
R68  Mounted: No  [0603]  (hidden comment: 0R)
R69  0R  [0603]
S2  MCDTSA6-5K  [MCDTSA6]
S3  MCDTSA6-2R  [MCDTSA6]

### Ports
ARM_2V5_GPIO_PD[10..13] (bidir), ARM_2V5_GPIO_PE[0..15] (bidir), ARM_3V3_GPIO_PB[0..7] (bidir), FAN_BOX_EN (in), FAN_PSU_EN (in), FPGA_GPIO[0..35] (bidir), I2C_IOs_SCL0 (out), I2C_IOs_SCL1 (out), I2C_IOs_SDA0 (bidir), I2C_IOs_SDA1 (bidir)

### Nets
+2V5: R61.1
+5V: J2.81 J2.82 J2.83 J2.84 J2.85 J2.86 J2.87 J2.88 J2.90 J2.92 J2.94 J2.96
+12VCC_IN: C44.1 C46.1 D1.1(K) Q3.3(S) Q4.3(S) R4.1 R60.1
CHASSIS: J6.6(SH)
CHASSIS1: J3.10(MH1) J3.11(MH2)
GND: C43.2 C44.2 C45.2 C46.2 IC1.1(GND) J2.89 J2.91 J2.93 J2.95 J2.97 J2.98 J2.99 J2.100 J2.101 J2.102 J2.103 J2.104 J2.105 J2.106 J2.107 J2.108 J3.5 J5.2 J6.5(GND) J7.2 J11.2 Q1.3(S) Q2.3(S) R1.2 R2.2 S2.2 S2.3 S2.4 S3.1 S3.3 S3.4
ARM_2V5_GPIO_PD10: J2.41  [also labelled PE8]
ARM_2V5_GPIO_PD11: J2.19  [also labelled TK1]
ARM_2V5_GPIO_PD12: J2.75  [also labelled PE1]
ARM_2V5_GPIO_PD13: J2.27  [also labelled RF1]
ARM_2V5_GPIO_PD14: J2.79 R61.2 S2.1  [also labelled PE9]
ARM_2V5_GPIO_PD15: J2.77  [also labelled PE7]
ARM_2V5_GPIO_PE0: J2.39  [also labelled PE13]
ARM_2V5_GPIO_PE1: J2.73  [also labelled PE2]
ARM_2V5_GPIO_PE2: J2.37  [also labelled PE14]
ARM_2V5_GPIO_PE3: J2.71  [also labelled PE6]
ARM_2V5_GPIO_PE4: J2.35  [also labelled PE12]
ARM_2V5_GPIO_PE5: J2.69  [also labelled PE0]
ARM_2V5_GPIO_PE6: J2.33  [also labelled PE10]
ARM_2V5_GPIO_PE7: J2.67  [also labelled PE5]
ARM_2V5_GPIO_PE8: J2.25  [also labelled RK1]
ARM_2V5_GPIO_PE9: J2.65  [also labelled PE15]
ARM_2V5_GPIO_PE10: J2.23  [also labelled RD1]
ARM_2V5_GPIO_PE11: J2.47  [also labelled PE11]
ARM_2V5_GPIO_PE12: J2.21  [also labelled TD1]
ARM_2V5_GPIO_PE13: J2.45  [also labelled PE3]
ARM_2V5_GPIO_PE14: J2.17  [also labelled TF1]
ARM_2V5_GPIO_PE15: J2.43  [also labelled PE4]
ARM_3V3_GPIO_PB0: J2.63  [also labelled PB7]
ARM_3V3_GPIO_PB1: J2.61  [also labelled PB5]
ARM_3V3_GPIO_PB2: J2.51  [also labelled PB3]
ARM_3V3_GPIO_PB3: J2.49  [also labelled PB6]
ARM_3V3_GPIO_PB4: J2.55  [also labelled PB2]
ARM_3V3_GPIO_PB5: J2.53  [also labelled PB1]
ARM_3V3_GPIO_PB6: J2.59  [also labelled PB4]
ARM_3V3_GPIO_PB7: J2.57  [also labelled PB0]
Boot_Select: J2.5 R68.2
EXT_NRST: J2.31
FAN_BOX_EN: Q2.1(G) R2.1 ; port FAN_BOX_EN
FAN_PSU_EN: Q1.1(G) R1.1 ; port FAN_PSU_EN
FBOOT_SEL: J2.29 R69.2
FPGA-GPIO0: J2.2  [also labelled FPGA_GPIO35]
FPGA-GPIO1: J2.4  [also labelled FPGA_GPIO34]
FPGA-GPIO2: J2.6  [also labelled FPGA_GPIO32]
FPGA-GPIO3: J2.8  [also labelled FPGA_GPIO29]
FPGA-GPIO4: J2.10  [also labelled FPGA_GPIO25]
FPGA-GPIO5: J2.12  [also labelled FPGA_GPIO21]
FPGA-GPIO6: J2.14  [also labelled FPGA_GPIO17]
FPGA-GPIO7: J2.16  [also labelled FPGA_GPIO13]
FPGA-GPIO8: J2.18  [also labelled FPGA_GPIO9]
FPGA-GPIO9: J2.20  [also labelled FPGA_GPIO5]
FPGA-GPIO10: J2.22  [also labelled FPGA_GPIO1]
FPGA-GPIO11: J2.24  [also labelled FPGA_GPIO33]
FPGA-GPIO12: J2.26  [also labelled FPGA_GPIO28]
FPGA-GPIO13: J2.28  [also labelled FPGA_GPIO30]
FPGA-GPIO14: J2.30  [also labelled FPGA_GPIO31]
FPGA-GPIO15: J2.32  [also labelled FPGA_GPIO24]
FPGA-GPIO16: J2.34  [also labelled FPGA_GPIO26]
FPGA-GPIO17: J2.36  [also labelled FPGA_GPIO27]
FPGA-GPIO18: J2.38  [also labelled FPGA_GPIO20]
FPGA-GPIO19: J2.40  [also labelled FPGA_GPIO22]
FPGA-GPIO20: J2.42  [also labelled FPGA_GPIO23]
FPGA-GPIO21: J2.44  [also labelled FPGA_GPIO16]
FPGA-GPIO22: J2.46  [also labelled FPGA_GPIO18]
FPGA-GPIO23: J2.48  [also labelled FPGA_GPIO19]
FPGA-GPIO24: J2.50  [also labelled FPGA_GPIO12]
FPGA-GPIO25: J2.52  [also labelled FPGA_GPIO14]
FPGA-GPIO26: J2.54  [also labelled FPGA_GPIO15]
FPGA-GPIO27: J2.56  [also labelled FPGA_GPIO8]
FPGA-GPIO28: J2.58  [also labelled FPGA_GPIO10]
FPGA-GPIO29: J2.60  [also labelled FPGA_GPIO11]
FPGA-GPIO30: J2.62  [also labelled FPGA_GPIO4]
FPGA-GPIO31: J2.64  [also labelled FPGA_GPIO6]
FPGA-GPIO32: J2.66  [also labelled FPGA_GPIO7]
FPGA-GPIO33: J2.68  [also labelled FPGA_GPIO0]
FPGA-GPIO34: J2.70  [also labelled FPGA_GPIO2]
FPGA-GPIO35: J2.72  [also labelled FPGA_GPIO3]
FPGA-GPIO36: J2.74 ; port I2C_IOs_SDA0
FPGA-GPIO37: J2.76 ; port I2C_IOs_SCL0
FPGA-GPIO38: J2.78 ; port I2C_IOs_SDA1
FPGA-GPIO39: J2.80 ; port I2C_IOs_SCL1
RS232_MNG_RXD: J2.3 J3.3
RS232_MNG_TXD: J2.1 J3.2
USB_5VBus: IC1.4(VCC) J2.7 J6.1(VBUS)
USB_DDP_N: IC1.2(I/O1) J2.9 J6.2(-D)
USB_DDP_P: IC1.3(I/O2) J2.11 J6.3(+D)
USB_HDP_N: J2.13
USB_HDP_P: J2.15
NetC43_1: C43.1 J11.1 R62.2
NetC45_1: C45.1 J5.1 R63.2
NetD1_2: D1.2(A) J7.1
NetJ3_1: J3.1 J3.4 J3.6
NetJ3_7: J3.7 J3.8
NetP1_1: P1.1 R68.1 R69.1 S3.2
NetQ1_2: Q1.2(D) R64.2
NetQ2_2: Q2.2(D) R65.2
NetQ3_1: Q3.1(G) R60.2 R64.1
NetQ3_2: Q3.2(D) R62.1
NetQ4_1: Q4.1(G) R4.2 R65.1
NetQ4_2: Q4.2(D) R63.1

Not connected (* = marked no-connect by the designer): J3 9; J6 4(ID)

### Buses and harness runs
bus ARM_2V5_GPIO_PD[10..13] = port ARM_2V5_GPIO_PD[10..13]
bus ARM_2V5_GPIO_PE[0..15] = port ARM_2V5_GPIO_PE[0..15]
bus ARM_3V3_GPIO_PB[0..7] = port ARM_3V3_GPIO_PB[0..7]
bus FPGA_GPIO[0..35] = port FPGA_GPIO[0..35]

### Layout directives
differential pair: USB_DDP_N, USB_DDP_P

### Notes on the sheet
- Boot select connected to pin 29 by default
- Green Labels: Net name on SCB schematics
  Red Labels: miniBackplane net name
- Level: 3.3 V LVCMOS
- Level: 2.5 V LVCMOS
- Copyright CERN 2011.
  This documentation describes Open Hardware and is licensed under the CERN OHL v. 1.1. You may redistribute and modify this documentation under the terms of the CERN OHL v.1.1. (http://ohwr.org/CERNOHL). This documentation is distributed WITHOUT ANY EXPRESS OR IMPLIED WARRANTY, INCLUDING OF MERCHANTABILITY, SATISFACTORY QUALITY AND FITNESS FOR A PARTICULAR PURPOSE. Please see the CERN OHL v.1.1 for applicable conditions.
- Labels drawn without touching a wire or pin: Boot_Select_SW

### Library data of the parts
C43-C46 = CC1206_22UF_25V_10%_X5R: Capacitor; Manufacturer1: Murata; Manufacturer1 PN: GRM31CR61E226KE15L; TC: X5R; Tolerance: ±10%; Published: 8-Jun-2000; LatestRevisionDate: 17-Jul-2002; LatestRevisionNote: Re-released for DXP Platform.; PackageReference: RAD-0.3; Publisher: Altium Limited; Distributor1: Digikey; Distributor1 PN: 490-5527-1-ND; Case: 1206
D1 = SK106-TP: Schottky Diode 10A 60V; Manufacturer1: Micro Commercial Components; Distributor1 PN: SK106-TPCT-ND; Manufacturer1 PN: SK106-TP; Distributor1: Digikey
IC1 = PRTR5V0U2X: as IC3 on sheet TEST_USB; Part Number: PRTR5V0U2X; Component Kind: Standard; Component Type: Standard; Device: PRTR5V0U2X; PackageDescription: SOT143B, SOT, 1.90mm Pitch; 4 Pin, 1.30mm W X 2.90mm L X 1.10mm H body, IPC Medium Density; Manufacturer Part Number: PRTR5V0U2X; Pin Count: 4; Case: SOT143B; Mounted: Yes; Socket: No; SMD: Yes; ComponentHeight: 1.1mm; HelpURL: \\cern.ch\dfs\Applications\Altium\Datasheets\PRTR5V0U2X.pdf; Author: CERN DEM JLC; CreateDate: 3/22/2011; LatestRevisionDate: 3/22/2011
J2 = QTS-048-01-L-D-DP: High Speed Ground Plane Header; Manufacturer1: Samtec; Manufacturer1 PN: QTS-048-01-L-D-DP
J3 = D Connector 9: Receptacle Assembly, 9 Position, Right Angle; Manufacturer1 PN: 1734348-1; Manufacturer1: TE Connectivity; PackageDocument: O; Positions: 9; Published: 15-Jun-2001; LatestRevisionDate: 17-Jul-2002; LatestRevisionNote: Re-released for DXP Platform.; DatasheetDocument: 1-Sep-1999; PackageReference: 788750; Publisher: Altium Limited; Orientation: Right Angle; Gender: Receptacle; Distributor1: Digikey; Distributor1 PN: A35109-ND
J5 J11 = CON2_619_0xx: Connector; Manufacturer1 PN: 61900211121; Manufacturer1: Wurth; Distributor1: Digikey; Distributor1 PN: 732-2695-ND
J6 = TYCO_1734035-1: 5 Pin + 1 Shield USB Receptacle; Part Description: 5 Position, Right Angle, SMD Mini USB Type B Receptacle; Manufacturer: TYCO ELECTRONICS; Table: TYCO; Part Number: TYCO_1734035-1; Component Kind: Standard; Component Type: Standard; Pin Count: 6; Family: USB; Mounted: Yes; Socket: No; SMD: Yes; Status: None; Manufacturer Part Number: 1734035-1; ComponentHeight: 3.95mm; HelpURL: \\cern.ch\dfs\Applications\Altium\Datasheets\TYCO_1734035-1.pdf; Author: CERN DEM JLC; CreateDate: 02/05/2011; LatestRevisionDate: 02/05/2011
J7 = Header 2: Header, 2-Pin; Manufacturer1 PN: 794120-1; Manufacturer1: Tyco Electronics; LatestRevisionDate: 17-Jul-2002; LatestRevisionNote: Re-released for DXP Platform.; Publisher: Altium Limited; Distributor1: Digikey; Distributor1 PN: A25753-ND
P1 = Plug: Manufacturer1 PN: RT-01T-1.0B(LF); Manufacturer1: JST; LatestRevisionDate: 17-Jul-2002; LatestRevisionNote: Re-released for DXP Platform.; Publisher: Altium Limited; Distributor1: Farnell; Distributor1 PN: 9492208
Q1 Q2 = DMN2020LSN-7: N-Channel Power MOSFET; Manufacturer: Diodes Inc.; Published: 8-Jun-2000; LatestRevisionDate: 17-Jul-2002; LatestRevisionNote: Re-released for DXP Platform.; DatasheetVersion: PD-9.814; Publisher: Altium Limited; ComponentLink1Description: Manufacturer Link; ComponentLink1URL: http://www.irf.com/; Value: DMN2020LSN-7; Distributor1: Digikey; Distributor1 PN: DMN2020LSN-7DICT-ND
Q3 Q4 = DMP2066LSN-7: P-Channel Enhancement MOSFET; Manufacturer: Diodes Inc.; Distributor1 PN: DMP2066LSNDICT-ND; Distributor1: Digikey; Case: SC-59; Manufacturer PN: DMP2066LSN-7
R1 R2 R4 R60 R61 R64 R65 = R0603_4.7K_±1%_0.1W_100PPM: as R8 on sheet Main; Case: 0603; Distributor1: DigiKey; Distributor1 PN: P4.70KHCT-ND; Value: 4K7
R62 R63 = R1210_1R0_±1%_1W_100PPM: SMD Resistor; Manufacturer1: Vishay Dale; Manufacturer1 PN: CRCW12101R00FKEA; TCR: 100ppm; Power Rating: 0.1W; Tolerance: ±1%; Case: 1210; Distributor1: DigiKey; Distributor1 PN: 541-1.00AAACT-ND; Value: 1R0
R68 R69 = R0603_0R_0.1W_JUMPER: SMD Resistor; Manufacturer1: Yageo; Manufacturer1 PN: RC0603JR-070RL; TCR: 200ppm; Power Rating: 0.1W; Case: 0603; Distributor1: DigiKey; Distributor1 PN: 311-0.0GRCT-ND; Tolerance: -; Value: 0R
S2 S3 = MCDTSA6: Push button SPNO Right Angle Through Hole; Manufacturer1: Multicomp; Distributor1: Farnell
  S2: Distributor1 PN: 9471790; Manufacturer1 PN: MCDTSA6-5K
  S3: Distributor1 PN: 9471855; Manufacturer1 PN: MCDTSA6-2R

## Nets that join several sheets
+2V5: Main (R8.2 R9.1 R10.2 R11.1), Connectors_GPIOs (R61.1)
CHASSIS: Main (C41.1), Connectors_GPIOs (J6.6)
CHASSIS1: Main (L7.2), TEST_USB (J4.6 J9.6), Connectors_GPIOs (J3.10 J3.11)
GND: Main (C41.2 L7.1), TEST_USB (16 pins), Connectors_GPIOs (36 pins)
FPGA-GPIO36: Main (R11.2), Connectors_GPIOs (J2.74)
FPGA-GPIO37: Main (R10.1), Connectors_GPIOs (J2.76)
FPGA-GPIO38: Main (R8.1), Connectors_GPIOs (J2.78)
FPGA-GPIO39: Main (R9.2), Connectors_GPIOs (J2.80)